# Altium schematic sheet Connectors.SchDoc
size 297 x 210 mm
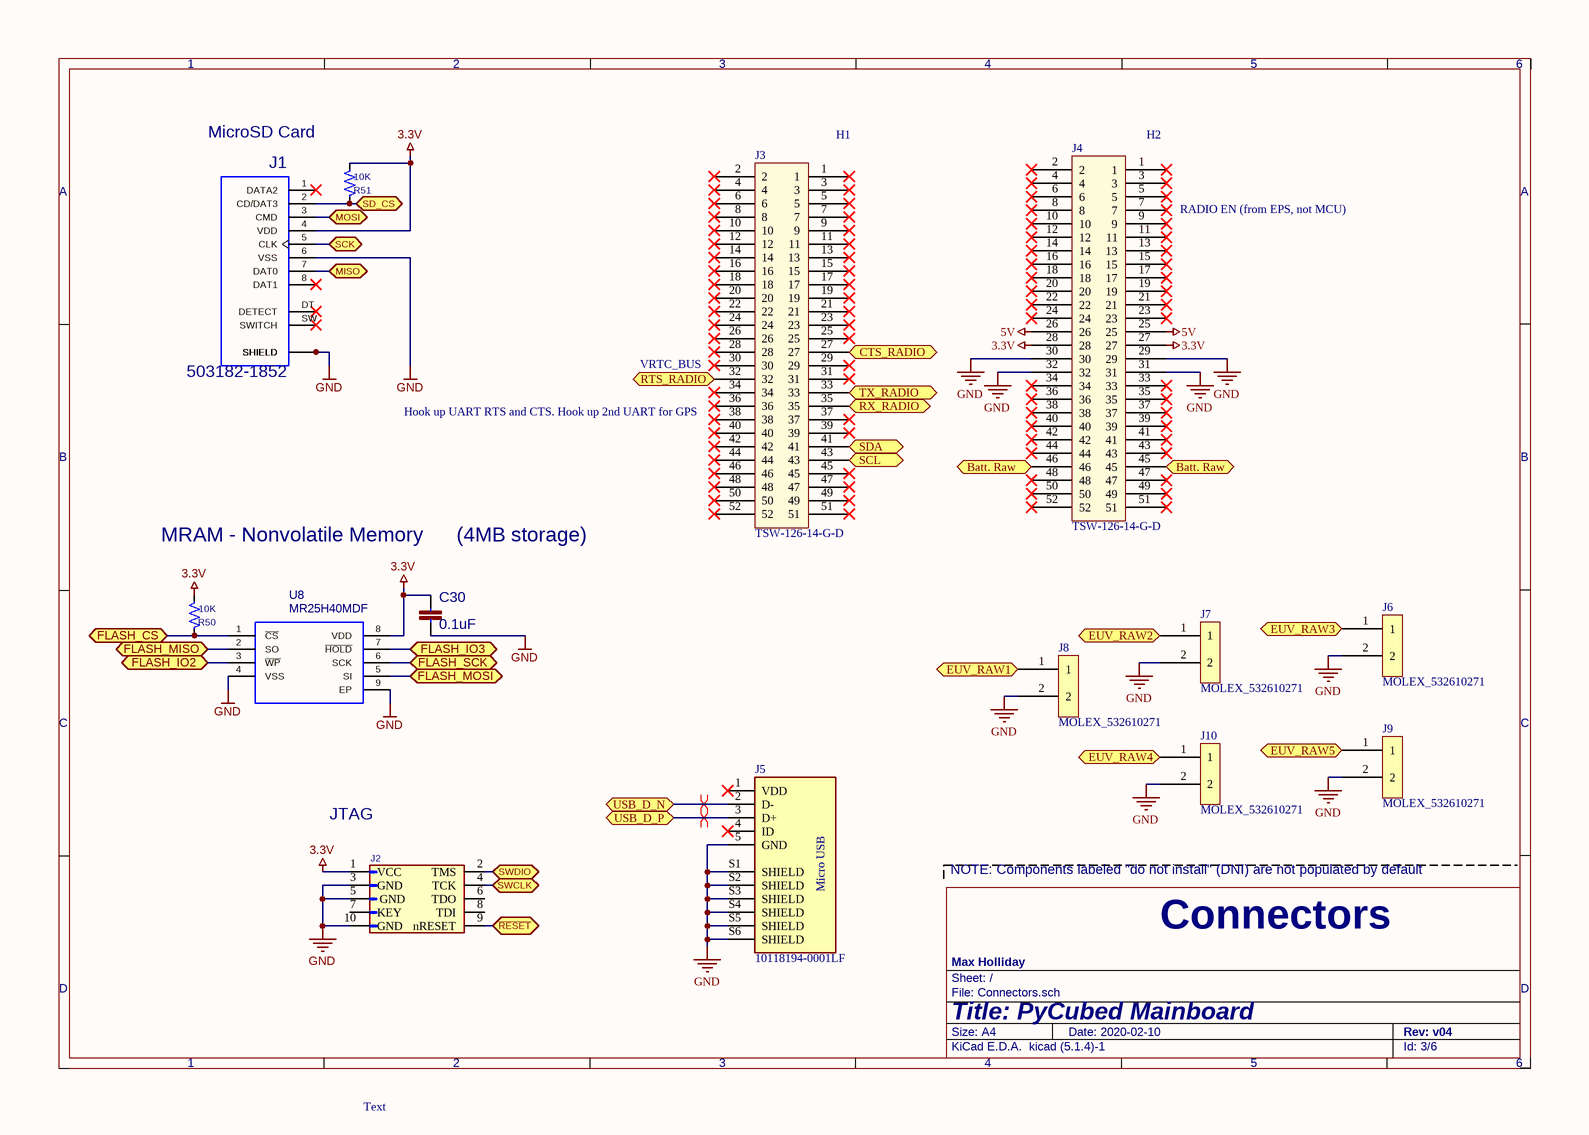
[diagram p0: Connectors.SchDoc]

## Parts
C30  0.1uF  [C_0603_1608Metric]
J1  503182-1852  [MOLEX_503182-1852]
J2  Conn_01x05  [PinHeader_1x05_P2.54mm_Vertical]  (value not drawn)  (no BOM)
J3  TSW-126-14-G-D  [SAMTEC_TSW-126-14-G-D]
J4  TSW-126-14-G-D  [SAMTEC_TSW-126-14-G-D]
J5  10118194-0001LF  [AMPHENOL_10118194-0001LF]
J6  MOLEX_532610271  [Molex_PicoBlade_532610271]
J7  MOLEX_532610271  [Molex_PicoBlade_532610271]
J8  MOLEX_532610271  [Molex_PicoBlade_532610271]
J9  MOLEX_532610271  [Molex_PicoBlade_532610271]
J10  MOLEX_532610271  [Molex_PicoBlade_532610271]
R50  10K  [R_0603_1608Metric]
R51  10K  [R_0603_1608Metric]
U8  MR25H40MDF  [SON127P600X500X90-9N]

## Ports
Batt. Raw (bidir), CTS_RADIO (bidir), EUV_RAW1 (bidir), EUV_RAW2 (bidir), EUV_RAW3 (bidir), EUV_RAW4 (bidir), EUV_RAW5 (bidir), FLASH_CS (bidir), FLASH_IO2 (bidir), FLASH_IO3 (bidir), FLASH_MISO (bidir), FLASH_MOSI (bidir), FLASH_SCK (bidir), MISO (bidir), MOSI (bidir), RTS_RADIO (bidir), RX_RADIO (bidir), SCK (bidir), SCL (bidir), SD_CS (bidir), SDA (bidir), SWCLK (bidir), SWDIO (bidir), TX_RADIO (bidir), USB_D_N (bidir), USB_D_P (bidir), ~{RESET} (bidir)

## Nets
3.3V: C30.1 J1.4(VDD) J2.1(VCC) J4.27 J4.28 R50.2 R51.2 U8.8(VDD)
5V: J4.25 J4.26
GND: C30.2 J1.6(VSS) J1.P1(SHIELD) J1.P2(SHIELD) J1.P3(SHIELD) J1.P4(SHIELD) J1.P5(SHIELD) J2.3(GND) J2.5(GND) J2.10(GND) J4.29 J4.30 J4.31 J4.32 J5.5(GND) J5.S1(SHIELD) J5.S2(SHIELD) J5.S3(SHIELD) J5.S4(SHIELD) J5.S5(SHIELD) J5.S6(SHIELD) J6.2 J7.2 J8.2 J9.2 J10.2 U8.4(VSS) U8.9(EP)
Batt. Raw: J4.45 J4.46 ; port Batt. Raw
CTS_RADIO: J3.27 ; port CTS_RADIO
EUV_RAW1: J8.1 ; port EUV_RAW1
EUV_RAW2: J7.1 ; port EUV_RAW2
EUV_RAW3: J6.1 ; port EUV_RAW3
EUV_RAW4: J10.1 ; port EUV_RAW4
EUV_RAW5: J9.1 ; port EUV_RAW5
FLASH_CS: R50.1 U8.1(~{CS}) ; port FLASH_CS
FLASH_IO2: U8.3(~{WP}) ; port FLASH_IO2
FLASH_IO3: U8.7(~{HOLD}) ; port FLASH_IO3
FLASH_MISO: U8.2(SO) ; port FLASH_MISO
FLASH_MOSI: U8.5(SI) ; port FLASH_MOSI
FLASH_SCK: U8.6(SCK) ; port FLASH_SCK
MISO: J1.7(DAT0) ; port MISO
MOSI: J1.3(CMD) ; port MOSI
~{RESET}: J2.9(nRESET) ; port ~{RESET}
RTS_RADIO: J3.32 ; port RTS_RADIO
RX_RADIO: J3.35 ; port RX_RADIO
SCK: J1.5(CLK) ; port SCK
SCL: J3.43 ; port SCL
SD_CS: J1.2(CD/DAT3) R51.1 ; port SD_CS
SDA: J3.41 ; port SDA
SWCLK: J2.4(TCK) ; port SWCLK
SWDIO: J2.2(TMS) ; port SWDIO
TX_RADIO: J3.33 ; port TX_RADIO
USB_D_N: J5.2(D-) ; port USB_D_N
USB_D_P: J5.3(D+) ; port USB_D_P

Not connected (* = marked no-connect by the designer): J1 1(DATA2)* 8(DAT1)* DT(DETECT)* SW(SWITCH)*; J2 6(TDO) 7(KEY) 8(TDI); J3 1* 2* 3* 4* 5* 6* 7* 8* 9* 10* 11* 12* 13* 14* 15* 16* 17* 18* 19* 20* 21* 22* 23* 24* 25* 26* 28* 29* 30* 31* 34* 36* 37* 38* 39* 40* 42* 44* 45* 46* 47* 48* 49* 50* 51* 52*; J4 1* 2* 3* 4* 5* 6* 7* 8* 9* 10* 11* 12* 13* 14* 15* 16* 17* 18* 19* 20* 21* 22* 23* 24* 33* 34* 35* 36* 37* 38* 39* 40* 41* 42* 43* 44* 47* 48* 49* 50* 51* 52*; J5 1(VDD)* 4(ID)*

## Layout directives
differential pair: USB_D_N, USB_D_P

## Notes on the sheet
- MicroSD Card
- (near J3) H1
- (near J4) H2
- RADIO EN (from EPS, not MCU)
- VRTC_BUS
- (near J3) Hook up UART RTS and CTS. Hook up 2nd UART for GPS
- MRAM - Nonvolatile Memory
  (4MB storage)
- (near J2) JTAG
- NOTE: Components labeled "do not install" (DNI) are not populated by default
- Connectors
- 1
- 2
- 3
- 4
- 5
- 6
- A
- B
- C
- D
- Title: PyCubed Mainboard
- File: Connectors.sch
- Sheet: /
- Max Holliday
- KiCad E.D.A.  kicad (5.1.4)-1
- Size: A4
- Date: 2020-02-10
- Rev: v04
- Id: 3/6
- (in symbol 10118194-0001LF) Micro USB
- (in symbol Conn_01x05) Text

## Library data of the parts
C30 = 2.2UF-0603-10V-20%: MPN: CL10B104KO8NNNC; Value: 0.1uF; Footprint: Capacitor_SMD:C_0603_1608Metric
J1 = 503182-1852: MPN: 5031821852; Value: 503182-1852; Footprint: mainboard:MOLEX_503182-1852
J5 = 10118194-0001LF: Micro Usb, 2.0 Type b, Rcpt, Smt; Price: None; MPN: 10118194-0001LF; Availability: Unavailable; Value: *; Package: None
J6-J10 = Molex_PicoBlade_532610271: MPN: 532610271
R50 R51 = R_US: MPN: CRGCQ0603J10K; Value: 10K; Footprint: Resistor_SMD:R_0603_1608Metric
U8 = MR25H40MDF: Proto: W25Q80DVSNIG; Value: MR25H40MDF; Footprint: mainboard:SON127P600X500X90-9N; MPN: MR25H40MDF
J2 = Conn_01x05: Value: Conn_01x05; Footprint: Connector_PinHeader_2.54mm:PinHeader_1x05_P2.54mm_Vertical
J3 J4 = TSW-126-14-G-D: MPN: TSW-126-14-G-D